# Altium schematic sheet relay.SchDoc
size A3
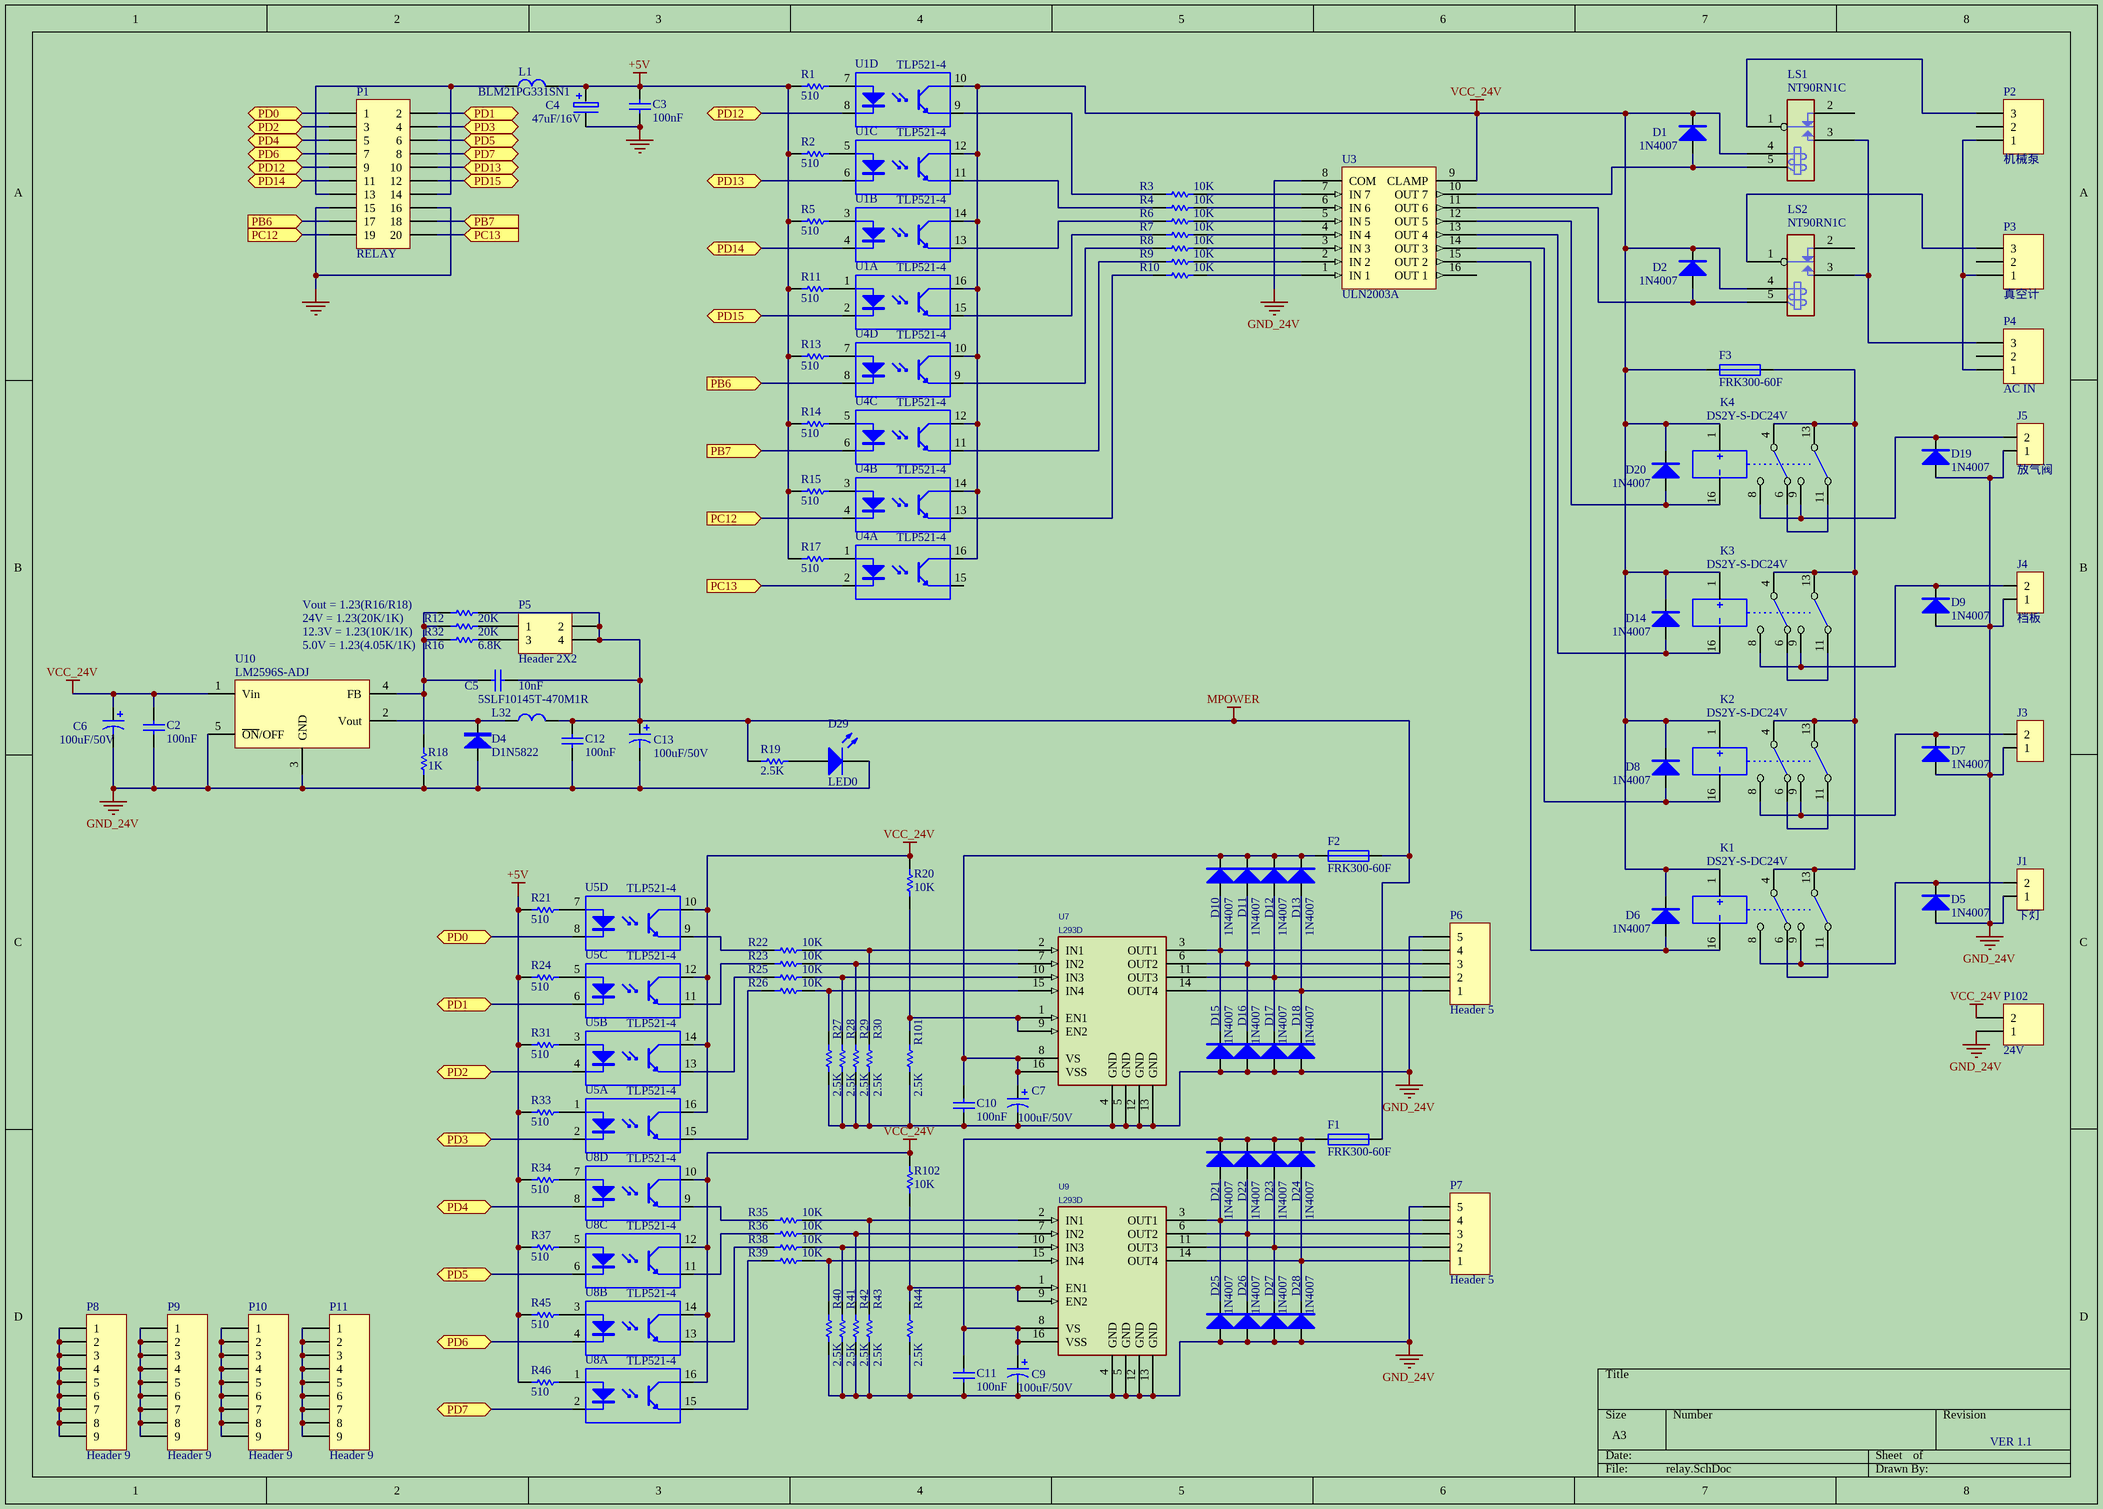
[diagram p0: relay.SchDoc]

## Parts
C2  100nF  [C0805]
C3  100nF  [C0805]
C4  47uF/16V  [CD1/2]
C5  10nF  [C0805]
C6  100uF/50V  [CD2/4]
C7  100uF/50V  [CD2/4]
C9  100uF/50V  [CD2/4]
C10  100nF  [C0805]
C11  100nF  [C0805]
C12  100nF  [C0805]
C13  100uF/50V  [CD2/4]
D1  1N4007  [V3]
D2  1N4007  [V3]
D4  D1N5822  [DO-201AD-H]
D5  1N4007  [V3]
D6  1N4007  [V3]
D7  1N4007  [V3]
D8  1N4007  [V3]
D9  1N4007  [V3]
D10  1N4007  [V3]
D11  1N4007  [V3]
D12  1N4007  [V3]
D13  1N4007  [V3]
D14  1N4007  [V3]
D15  1N4007  [V3]
D16  1N4007  [V3]
D17  1N4007  [V3]
D18  1N4007  [V3]
D19  1N4007  [V3]
D20  1N4007  [V3]
D21  1N4007  [V3]
D22  1N4007  [V3]
D23  1N4007  [V3]
D24  1N4007  [V3]
D25  1N4007  [V3]
D26  1N4007  [V3]
D27  1N4007  [V3]
D28  1N4007  [V3]
D29  LED0  [LED0805]
F1  FRK300-60F  [RAD-0.2]
F2  FRK300-60F  [RAD-0.2]
F3  FRK300-60F  [RAD-0.2]
J1  下灯  [3.96-2]
J3  Valve  [3.96-2]  (value not drawn)
J4  档板  [3.96-2]
J5  放气阀  [3.96-2]
K1  DS2Y-S-DC24V  [DS2Y-S]
K2  DS2Y-S-DC24V  [DS2Y-S]
K3  DS2Y-S-DC24V  [DS2Y-S]
K4  DS2Y-S-DC24V  [DS2Y-S]
L1  BLM21PG331SN1  [L0805]
L32  5SLF10145T-470M1R  [SLF10145]
LS1  NT90RN1C  [NT90HCE12CE]
LS2  NT90RN1C  [NT90HCE12CE]
P1  RELAY  [IDC20-EJ]
P2  机械泵  [3.96-3]
P3  真空计  [3.96-3]
P4  AC IN  [3.96-3]
P5  Header 2X2  [HDR2X2]
P6  Header 5  [3.96-5]
P7  Header 5  [3.96-5]
P8  Header 9  [LK]
P9  Header 9  [LK]
P10  Header 9  [LK]
P11  Header 9  [LK]
P102  24V  [3.96-2]
R1  510  [R0805]
R2  510  [R0805]
R3  10K  [R0805]
R4  10K  [R0805]
R5  510  [R0805]
R6  10K  [R0805]
R7  10K  [R0805]
R8  10K  [R0805]
R9  10K  [R0805]
R10  10K  [R0805]
R11  510  [R0805]
R12  20K  [R0805]
R13  510  [R0805]
R14  510  [R0805]
R15  510  [R0805]
R16  6.8K  [R0805]
R17  510  [R0805]
R18  1K  [R0805]
R19  2.5K  [R0805]
R20  10K  [R0805]
R21  510  [R0805]
R22  10K  [R0805]
R23  10K  [R0805]
R24  510  [R0805]
R25  10K  [R0805]
R26  10K  [R0805]
R27  2.5K  [R0805]
R28  2.5K  [R0805]
R29  2.5K  [R0805]
R30  2.5K  [R0805]
R31  510  [R0805]
R32  20K  [R0805]
R33  510  [R0805]
R34  510  [R0805]
R35  10K  [R0805]
R36  10K  [R0805]
R37  510  [R0805]
R38  10K  [R0805]
R39  10K  [R0805]
R40  2.5K  [R0805]
R41  2.5K  [R0805]
R42  2.5K  [R0805]
R43  2.5K  [R0805]
R44  2.5K  [R0805]
R45  510  [R0805]
R46  510  [R0805]
R101  2.5K  [R0805]
R102  10K  [R0805]
U1  TLP521-4  [DIP16]  (parts A,B,C,D of 4)
U3  ULN2003A  [so16]
U4  TLP521-4  [DIP16]  (parts A,B,C,D of 4)
U5  TLP521-4  [DIP16]  (parts A,B,C,D of 4)
U7  L293D  [DIP16]
U8  TLP521-4  [DIP16]  (parts A,B,C,D of 4)
U9  L293D  [DIP16]
U10  LM2596S-ADJ  [TO263-5]

## Ports
PB6 (in), PB7 (in), PC12 (in), PC13 (in), PD0, PD1, PD2, PD3, PD4, PD5, PD6, PD7, PD12, PD13, PD14, PD15

## Nets
+5V: C3.2 C4.1 L1.2 R1.2 R2.2 R5.2 R11.2 R13.2 R14.2 R15.2 R17.2 R21.2 R24.2 R31.2 R33.2 R34.2 R37.2 R45.2 R46.2
GND: C3.1 C4.2 P1.15 P1.16
GND_24V: C2.1 C6.2 C7.2 C9.2 C10.1 C11.1 C12.1 C13.2 D4.1 D5.1(A) D7.1(A) D9.1(A) D15.1(A) D16.1(A) D17.1(A) D18.1(A) D19.1(A) D25.1(A) D26.1(A) D27.1(A) D28.1(A) D29.2(K) J1.1 J3.1 J4.1 J5.1 P6.5 P7.5 P102.1 R18.2 R27.1 R28.1 R29.1 R30.1 R40.1 R41.1 R42.1 R43.1 R44.1 R101.1 U3.8(COM) U7.4(GND) U7.5(GND) U7.12(GND) U7.13(GND) U9.4(GND) U9.5(GND) U9.12(GND) U9.13(GND) U10.3(GND) U10.5(~{ON}/OFF)
MPOWER: C5.1 C12.2 C13.1 F1.2 F2.2 L32.2 P5.2 P5.4 R12.2 R19.2
VCC_24V: C2.2 C6.1 D1.2(K) D2.2(K) D6.2(K) D8.2(K) D14.2(K) D20.2(K) F3.1 K1.1(+) K2.1(+) K3.1(+) K4.1(+) LS1.4(COIL1) LS2.4(COIL1) P102.2 R20.2 R102.1 U1.10(C) U1.12(C) U1.14(C) U1.16(C) U3.9(CLAMP) U4.10(C) U4.12(C) U4.14(C) U4.16(C) U5.10(C) U5.12(C) U5.14(C) U5.16(C) U8.10(C) U8.12(C) U8.14(C) U8.16(C) U10.1(Vin)
PB6: P1.17 U4.8(K) ; port PB6
PB7: P1.18 U4.6(K) ; port PB7
PC12: P1.19 U4.4(K) ; port PC12
PC13: P1.20 U4.2(K) ; port PC13
PD0: P1.1 U5.8(K) ; port PD0
PD1: P1.2 U5.6(K) ; port PD1
PD2: P1.3 U5.4(K) ; port PD2
PD3: P1.4 U5.2(K) ; port PD3
PD4: P1.5 U8.8(K) ; port PD4
PD5: P1.6 U8.6(K) ; port PD5
PD6: P1.7 U8.4(K) ; port PD6
PD7: P1.8 U8.2(K) ; port PD7
PD12: P1.9 U1.8(K) ; port PD12
PD13: P1.10 U1.6(K) ; port PD13
PD14: P1.11 U1.4(K) ; port PD14
PD15: P1.12 U1.2(K) ; port PD15
NetC5_2: C5.2 R12.1 R16.1 R18.1 R32.1 U10.4(FB)
NetC7_1: C7.1 C10.2 D10.2(K) D11.2(K) D12.2(K) D13.2(K) F2.1 U7.8(VS) U7.16(VSS)
NetC9_1: C9.1 C11.2 D21.2(K) D22.2(K) D23.2(K) D24.2(K) F1.1 U9.8(VS) U9.16(VSS)
NetD1_1: D1.1(A) LS1.5(COIL2) U3.10(OUT_7)
NetD2_1: D2.1(A) LS2.5(COIL2) U3.11(OUT_6)
NetD4_2: D4.2 L32.1 U10.2(Vout)
NetD5_2: D5.2(K) J1.2 K1.8(N.O.) K1.9(N.O.)
NetD6_1: D6.1(A) K1.16(-) U3.15(OUT_2)
NetD7_2: D7.2(K) J3.2 K2.8(N.O.) K2.9(N.O.)
NetD8_1: D8.1(A) K2.16(-) U3.14(OUT_3)
NetD9_2: D9.2(K) J4.2 K3.8(N.O.) K3.9(N.O.)
NetD10_1: D10.1(A) D15.2(K) P6.4 U7.3(OUT1)
NetD11_1: D11.1(A) D16.2(K) P6.3 U7.6(OUT2)
NetD12_1: D12.1(A) D17.2(K) P6.2 U7.11(OUT3)
NetD13_1: D13.1(A) D18.2(K) P6.1 U7.14(OUT4)
NetD14_1: D14.1(A) K3.16(-) U3.13(OUT_4)
NetD19_2: D19.2(K) J5.2 K4.8(N.O.) K4.9(N.O.)
NetD20_1: D20.1(A) K4.16(-) U3.12(OUT_5)
NetD21_1: D21.1(A) D25.2(K) P7.4 U9.3(OUT1)
NetD22_1: D22.1(A) D26.2(K) P7.3 U9.6(OUT2)
NetD23_1: D23.1(A) D27.2(K) P7.2 U9.11(OUT3)
NetD24_1: D24.1(A) D28.2(K) P7.1 U9.14(OUT4)
NetD29_1: D29.1(A) R19.1
NetF3_2: F3.2 K1.4(COM) K1.13(COM) K2.4(COM) K2.13(COM) K3.4(COM) K3.13(COM) K4.4(COM) K4.13(COM)
NetK1_6: K1.6(N.C.) K1.11(N.C.)
NetK2_6: K2.6(N.C.) K2.11(N.C.)
NetK3_6: K3.6(N.C.) K3.11(N.C.)
NetK4_6: K4.6(N.C.) K4.11(N.C.)
NetL1_1: L1.1 P1.13 P1.14
NetLS1_1: LS1.1(COMMON) P2.3
NetLS1_3: LS1.3(NO) LS2.3(NO) P4.3
NetLS2_1: LS2.1(COMMON) P3.3
NetP2_1: P2.1 P3.1 P4.1
NetP5_1: P5.1 R32.2
NetP5_3: P5.3 R16.2
NetP8_1: P8.1 P8.2 P8.3 P8.4 P8.5 P8.6 P8.7 P8.8 P8.9
NetP9_1: P9.1 P9.2 P9.3 P9.4 P9.5 P9.6 P9.7 P9.8 P9.9
NetP10_1: P10.1 P10.2 P10.3 P10.4 P10.5 P10.6 P10.7 P10.8 P10.9
NetP11_1: P11.1 P11.2 P11.3 P11.4 P11.5 P11.6 P11.7 P11.8 P11.9
NetR1_1: R1.1 U1.7(A)
NetR2_1: R2.1 U1.5(A)
NetR3_1: R3.1 U1.9(E)
NetR3_2: R3.2 U3.7(IN_7)
NetR4_1: R4.1 U1.11(E)
NetR4_2: R4.2 U3.6(IN_6)
NetR5_1: R5.1 U1.3(A)
NetR6_1: R6.1 U1.13(E)
NetR6_2: R6.2 U3.5(IN_5)
NetR7_1: R7.1 U1.15(E)
NetR7_2: R7.2 U3.4(IN_4)
NetR8_1: R8.1 U4.9(E)
NetR8_2: R8.2 U3.3(IN_3)
NetR9_1: R9.1 U4.11(E)
NetR9_2: R9.2 U3.2(IN_2)
NetR10_1: R10.1 U4.13(E)
NetR10_2: R10.2 U3.1(IN_1)
NetR11_1: R11.1 U1.1(A)
NetR13_1: R13.1 U4.7(A)
NetR14_1: R14.1 U4.5(A)
NetR15_1: R15.1 U4.3(A)
NetR17_1: R17.1 U4.1(A)
NetR20_1: R20.1 R101.2 U7.1(EN1) U7.9(EN2)
NetR21_1: R21.1 U5.7(A)
NetR22_1: R22.1 U5.9(E)
NetR22_2: R22.2 R30.2 U7.2(IN1)
NetR23_1: R23.1 U5.11(E)
NetR23_2: R23.2 R29.2 U7.7(IN2)
NetR24_1: R24.1 U5.5(A)
NetR25_1: R25.1 U5.13(E)
NetR25_2: R25.2 R28.2 U7.10(IN3)
NetR26_1: R26.1 U5.15(E)
NetR26_2: R26.2 R27.2 U7.15(IN4)
NetR31_1: R31.1 U5.3(A)
NetR33_1: R33.1 U5.1(A)
NetR34_1: R34.1 U8.7(A)
NetR35_1: R35.1 U8.9(E)
NetR35_2: R35.2 R43.2 U9.2(IN1)
NetR36_1: R36.1 U8.11(E)
NetR36_2: R36.2 R42.2 U9.7(IN2)
NetR37_1: R37.1 U8.5(A)
NetR38_1: R38.1 U8.13(E)
NetR38_2: R38.2 R41.2 U9.10(IN3)
NetR39_1: R39.1 U8.15(E)
NetR39_2: R39.2 R40.2 U9.15(IN4)
NetR44_2: R44.2 R102.2 U9.1(EN1) U9.9(EN2)
NetR45_1: R45.1 U8.3(A)
NetR46_1: R46.1 U8.1(A)

Not connected (* = marked no-connect by the designer): LS1 2(NC); LS2 2(NC); P2 2; P3 2; P4 2; U3 16(OUT_1); U4 15(E)

## Notes on the sheet
- Vout = 1.23(R16/R18)
- 12.3V = 1.23(10K/1K)
- 5.0V = 1.23(4.05K/1K)
- 24V = 1.23(20K/1K)
- VER 1.1

## Library data of the parts
C2 C3 C10-C12 = Cap: Capacitor; Published: 8-Jun-2000; LatestRevisionDate: 17-Jul-2002; LatestRevisionNote: Re-released for DXP Platform.; PackageReference: RAD-0.3; Publisher: Altium Limited; Value: 100nF
C4 = CD1: Electrolytic Capacitor; Text Field1: 4.7uF:4V-A;6.3V-A;10V-A;16V-BA;20V-BA;25V-CB;35V-DC;50V-D;; Text Field2: 10uF:4V-AB;6.3V-BA;10V-BA;16V-CBA;20V-CB;25V-DC;35V-D;; Text Field3: 22uF:4V-BA;6.3V-CBA;10V-CB;16V-DBC;20V-DC;25V-D;35V-D;; Text Field4: 33uF:4V-CAB;6.3V-CBA;10V-DBC;16V-DCB;20V-DC;25V-DE;; Text Field5: 47uF:4V-CBA;6.3V-DBC;10V-DBC;16V-DC;20V-DE;; Text Field6: 68uF:4V-DBC;6.3V-DCB;10V-DCB;16V-D;20V-DE;; Text Field7: 100uF:4V-DCB;6.3V-EDBC;10V-DC;16V-DE;20V-E;; Text Field8: 220uF:4V-EDC;6.3V-ED;10V-ED;
C5 = Cap: Capacitor; Value: 100nF; Published: 8-Jun-2000; LatestRevisionDate: 17-Jul-2002; LatestRevisionNote: Re-released for DXP Platform.; PackageReference: RAD-0.3; Publisher: Altium Limited
C6 C7 C9 C13 = Cap Pol1: Polarized Capacitor (Radial); Value: 100pF; Published: 8-Jun-2000; LatestRevisionDate: 17-Jul-2002; LatestRevisionNote: Re-released for DXP Platform.; PackageReference: RB7.6-15; Publisher: Altium Limited
D1 D2 D5-D28 = 2JG: Diode
D4 = DIODE
D29 = LED0: Typical INFRARED GaAs LED; Published: 8-Jun-2000; LatestRevisionDate: 08-Jul-2005; LatestRevisionNote: Mech Layer 1 removed.; PackageReference: LED-0; Publisher: Altium Limited
F1-F3 = FUSE1: Fuse
J1 J3-J5 = CON2: Connector
K1-K4 = DS2Y-S: Text Field1: 22; Text Field2: 102
L1 L32 = L1
P1 = Header 10X2: Header, 10-Pin, Dual row; LatestRevisionDate: 17-Jul-2002; LatestRevisionNote: Re-released for DXP Platform.; Publisher: Altium Limited
P2-P4 = Header 3H: Header, 3-Pin, Right Angle; LatestRevisionDate: 17-Jul-2002; LatestRevisionNote: Re-released for DXP Platform.; Publisher: Altium Limited
P5 = Header 2X2: Header, 2-Pin, Dual row; LatestRevisionDate: 17-Jul-2002; LatestRevisionNote: Re-released for DXP Platform.; Publisher: Altium Limited
P6 P7 = Header 5: Header, 5-Pin; LatestRevisionDate: 17-Jul-2002; LatestRevisionNote: Re-released for DXP Platform.; Publisher: Altium Limited
P8-P11 = Header 9: Header, 9-Pin; LatestRevisionDate: 17-Jul-2002; LatestRevisionNote: Re-released for DXP Platform.; Publisher: Altium Limited
P102 = Header 2: Header, 2-Pin; LatestRevisionDate: 17-Jul-2002; LatestRevisionNote: Re-released for DXP Platform.; Publisher: Altium Limited
R1-R17 R20-R46 R101 R102 = Res1: Resistor; Value: 1K; Published: 8-Jun-2000; LatestRevisionDate: 17-Jul-2002; LatestRevisionNote: Re-released for DXP Platform.; PackageReference: AXIAL-0.3; Publisher: Altium Limited
R18 = Res1: Resistor; Published: 8-Jun-2000; LatestRevisionDate: 17-Jul-2002; LatestRevisionNote: Re-released for DXP Platform.; PackageReference: AXIAL-0.3; Publisher: Altium Limited; Value: 1K
R19 = Res1: Resistor; Value: 2.2K; Published: 8-Jun-2000; LatestRevisionDate: 17-Jul-2002; LatestRevisionNote: Re-released for DXP Platform.; PackageReference: AXIAL-0.3; Publisher: Altium Limited
U1 U4 U5 U8 = TLP521-4: Text Field1: 80; Text Field2: 50
U3 = ULN2003A: HIGH-VOLTAGE,HIGH-CURRENT DARLINGTON ARRAYS
U7 U9 = L293D_0
U10 = LM2596: SIMPLESWITCHER PowerConverter150kHz 3A Step-DownVoltageRegulator